# Altium schematic sheet CH340K.SchDoc
size A4; SheetNumber: 2; SheetTotal: 4
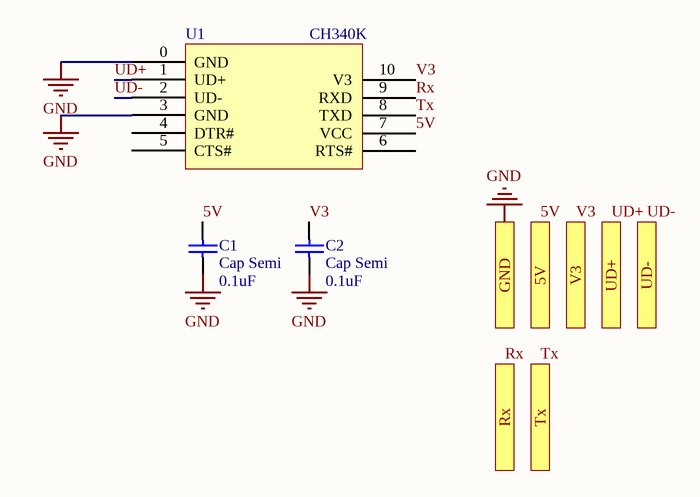
[diagram p0: CH340K.SchDoc]

## Parts
C1  Cap Semi  value 0.1uF  [1608[0603]]
C2  Cap Semi  value 0.1uF  [1608[0603]]
U1  CH340K  [ESSOP-10]

## Ports
5V, GND, Rx, Tx, UD+, UD-, V3

## Nets
GND: C1.2 C2.2 U1.0(GND) U1.3(GND) ; port GND
5V: C1.1 U1.7(VCC) ; port 5V
Rx: U1.9(RXD) ; port Rx
Tx: U1.8(TXD) ; port Tx
UD+: U1.1(UD+) ; port UD+
UD-: U1.2(UD-) ; port UD-
V3: C2.1 U1.10(V3) ; port V3

Not connected (* = marked no-connect by the designer): U1 4(DTR#) 5(CTS#) 6(RTS#)

## Library data of the parts
C1 C2 = Cap Semi: Capacitor (Semiconductor SIM Model); Published: 8-Jun-2000; LatestRevisionDate: 29-May-2009; LatestRevisionNote: IPC-7351 Footprint Added.; PackageReference: C1206; Publisher: Altium Limited; PackageDescription: Chip Capacitor